# Altium schematic sheet [15] - ETHERNET PHY.SchDoc
size A2; DocumentNumber: 15; SheetNumber: 15; SheetTotal: 32
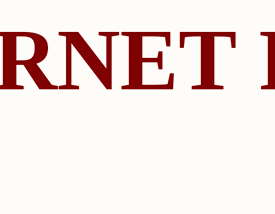
[diagram p0: [15] - ETHERNET PHY.SchDoc, top left]
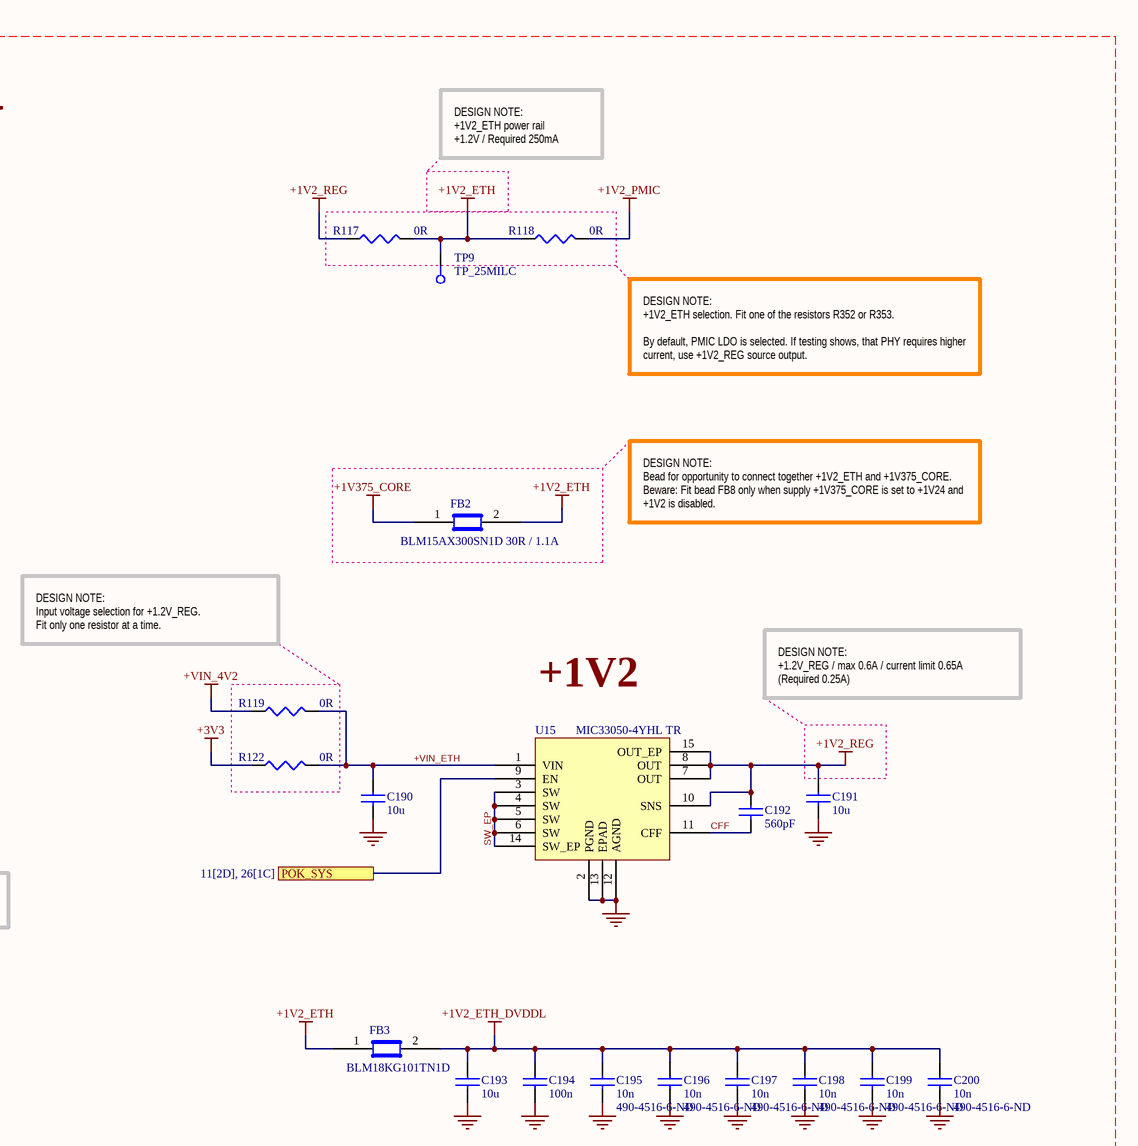
[diagram p1: [15] - ETHERNET PHY.SchDoc, top right]
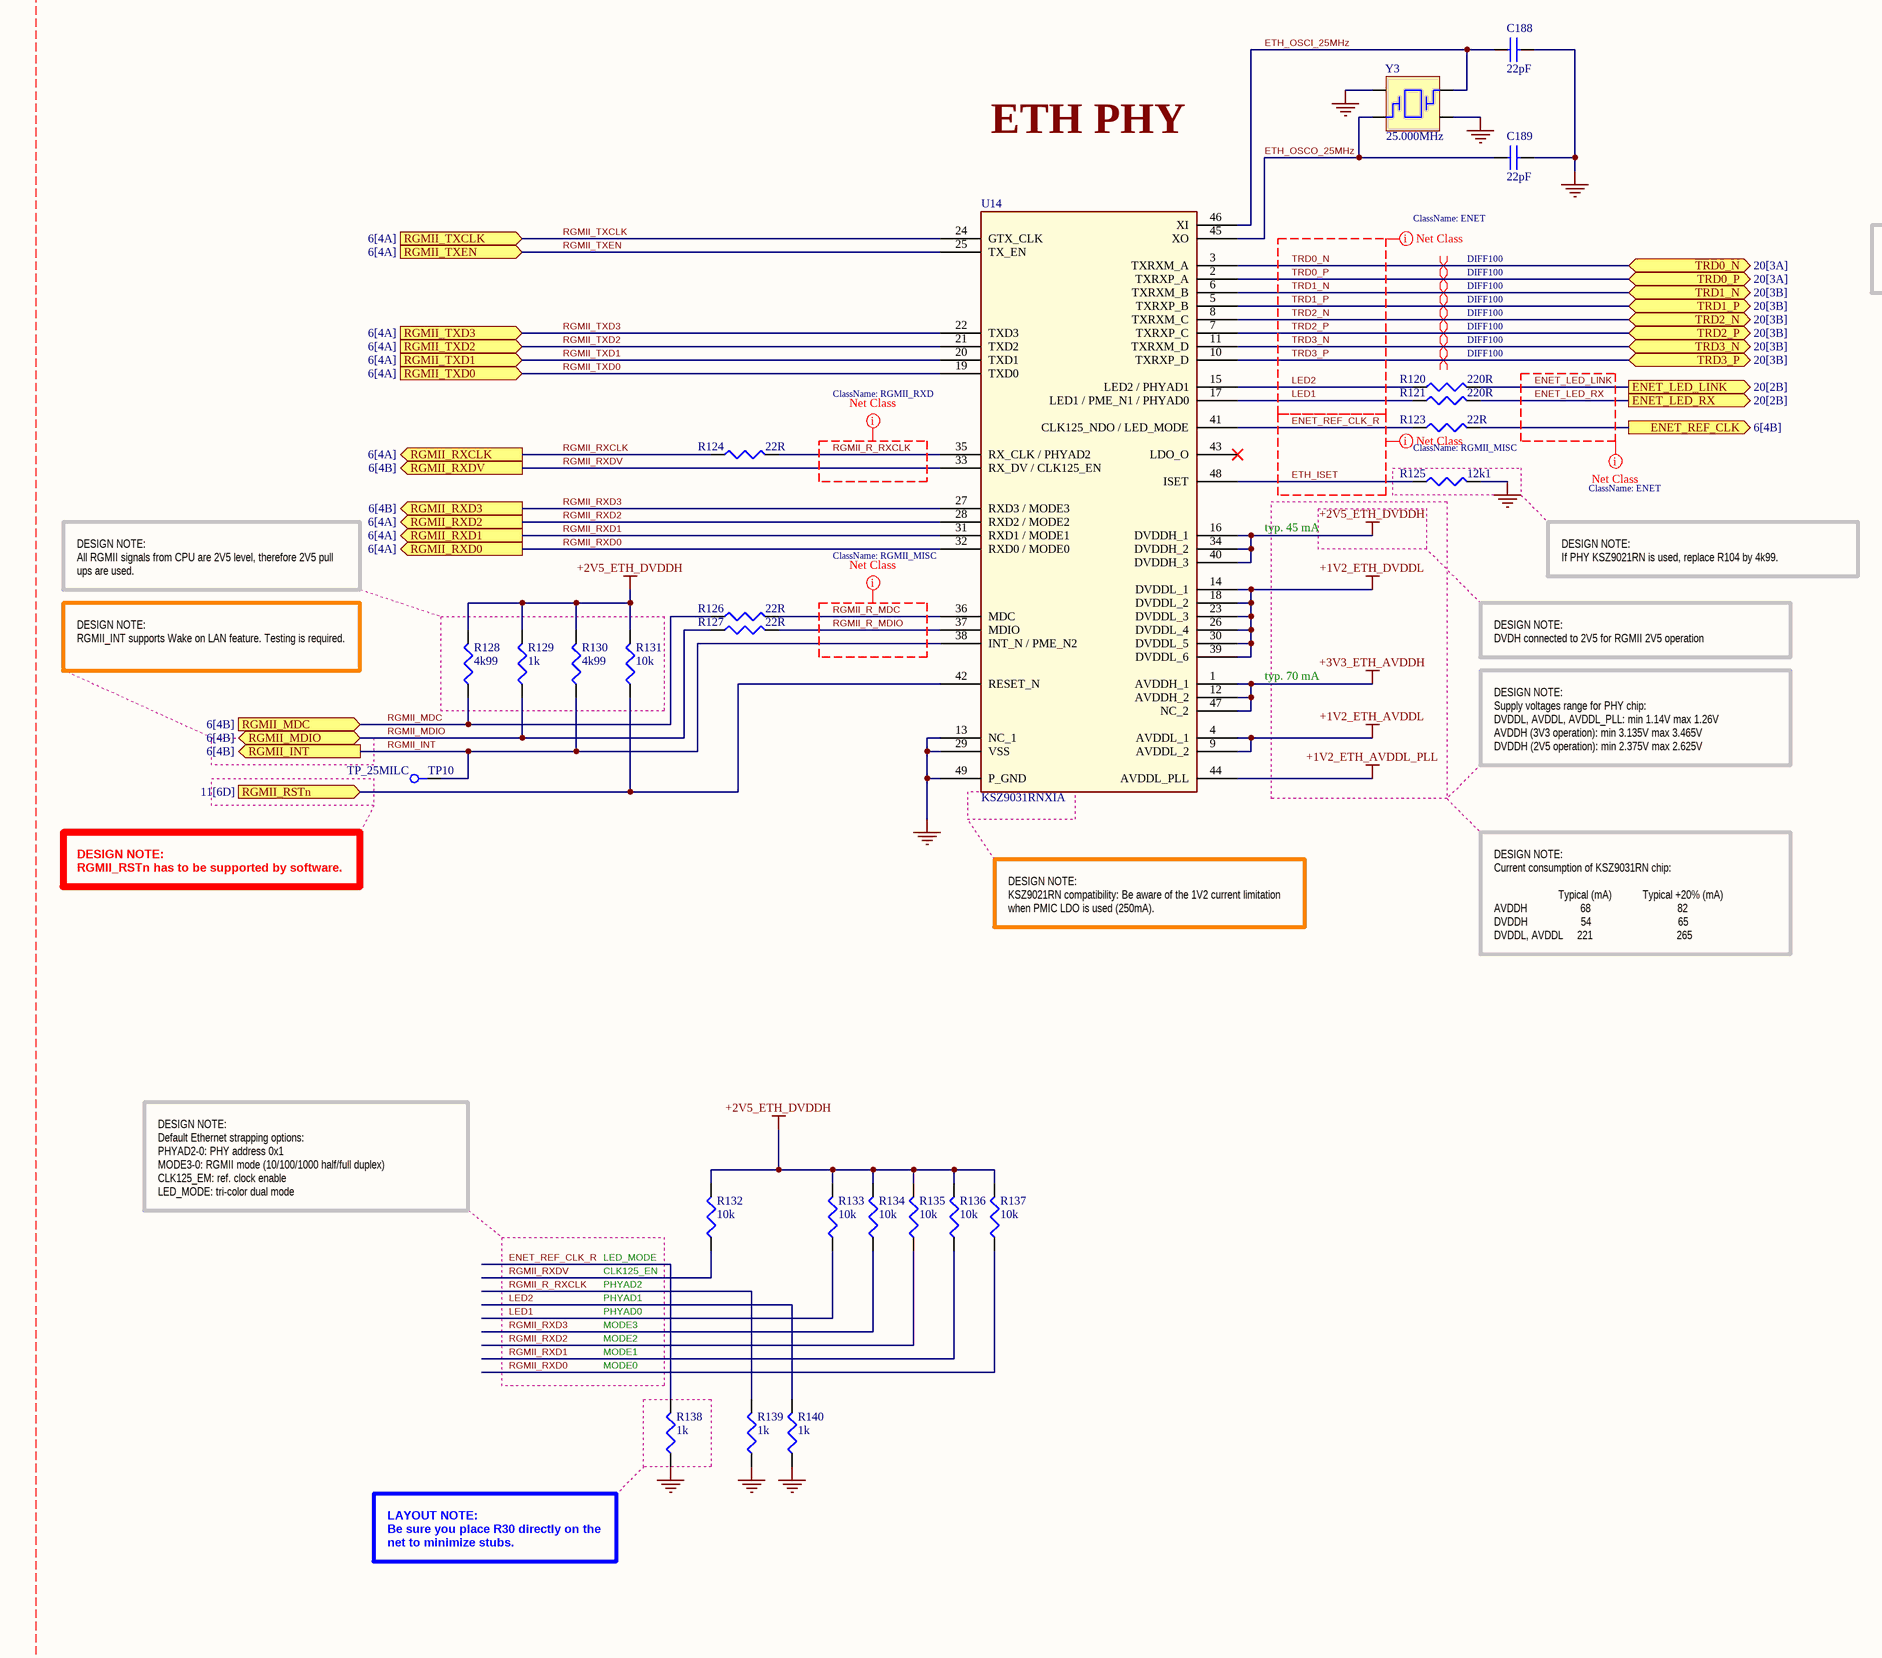
[diagram p2: [15] - ETHERNET PHY.SchDoc, bottom left]
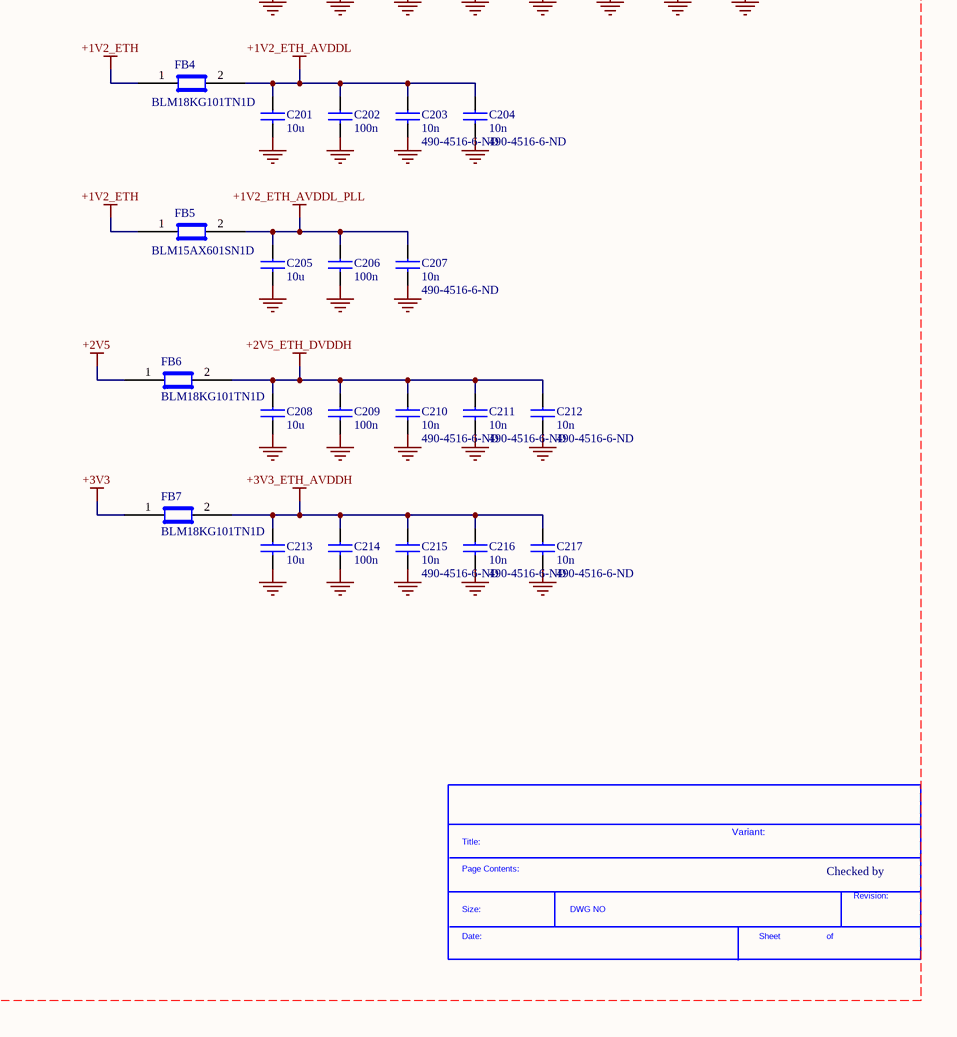
[diagram p3: [15] - ETHERNET PHY.SchDoc, bottom right]

## Parts
*  SDTitleBlock  (value not drawn)  (graphical)
C188  22pF  [C0402]
C189  22pF  [C0402]
C190  10u  [C0603]
C191  10u  [C0603]
C192  560pF  [C0402]
C193  10u  [C0603]
C194  100n  [C0402]
C195  10n  Supplier Part Number 2: 490-4516-6-ND  [C0402]
C196  10n  Supplier Part Number 2: 490-4516-6-ND  [C0402]
C197  10n  Supplier Part Number 2: 490-4516-6-ND  [C0402]
C198  10n  Supplier Part Number 2: 490-4516-6-ND  [C0402]
C199  10n  Supplier Part Number 2: 490-4516-6-ND  [C0402]
C200  10n  Supplier Part Number 2: 490-4516-6-ND  [C0402]
C201  10u  [C0603]
C202  100n  [C0402]
C203  10n  Supplier Part Number 2: 490-4516-6-ND  [C0402]
C204  10n  Supplier Part Number 2: 490-4516-6-ND  [C0402]
C205  10u  [C0603]
C206  100n  [C0402]
C207  10n  Supplier Part Number 2: 490-4516-6-ND  [C0402]
C208  10u  [C0603]
C209  100n  [C0402]
C210  10n  Supplier Part Number 2: 490-4516-6-ND  [C0402]
C211  10n  Supplier Part Number 2: 490-4516-6-ND  [C0402]
C212  10n  Supplier Part Number 2: 490-4516-6-ND  [C0402]
C213  10u  [C0603]
C214  100n  [C0402]
C215  10n  Supplier Part Number 2: 490-4516-6-ND  [C0402]
C216  10n  Supplier Part Number 2: 490-4516-6-ND  [C0402]
C217  10n  Supplier Part Number 2: 490-4516-6-ND  [C0402]
FB2  BLM15AX300SN1D 30R / 1.1A  [C0402]
FB3  BLM18KG101TN1D  [C0603]
FB4  BLM18KG101TN1D  [C0603]
FB5  BLM15AX601SN1D  [C0402]
FB6  BLM18KG101TN1D  [C0603]
FB7  BLM18KG101TN1D  [C0603]
R117  0R  [R0402]
R118  0R  [R0402]
R119  0R  [R0402]
R120  220R  [R0402]
R121  220R  [R0402]
R122  0R  [R0402]
R123  22R  [R0402]
R124  22R  [R0402]
R125  12k1  [R0402]
R126  22R  [R0402]
R127  22R  [R0402]
R128  4k99  [R0402]
R129  1k  [R0402]
R130  4k99  [R0402]
R131  10k  [R0402]
R132  10k  [R0402]
R133  10k  [R0402]
R134  10k  [R0402]
R135  10k  [R0402]
R136  10k  [R0402]
R137  10k  [R0402]
R138  1k  [R0402]
R139  1k  [R0402]
R140  1k  [R0402]
TP9  TP_25MILC  [TP_25C]  (no BOM)
TP10  TP_25MILC  [TP_25C]  (no BOM)
U14  KSZ9031RNXIA  [QFN48_SMALL_EP_7MMX7MM]
U15  MIC33050-4YHL TR  [MLF_3x3_12PINS]
Y3  25.000MHz  [ABM8G]

## Ports
ENET_LED_LINK (out, see 20[2B]), ENET_LED_RX (out, see 20[2B]), ENET_REF_CLK (out, see 6[4B]), POK_SYS (see 11[2D], 26[1C]), RGMII_INT (out, see 6[4B]), RGMII_MDC (in, see 6[4B]), RGMII_MDIO (bidir, see 6[4B]), RGMII_RSTn (in, see 11[6D]), RGMII_RXCLK (out, see 6[4A]), RGMII_RXD0 (out, see 6[4A]), RGMII_RXD1 (out, see 6[4A]), RGMII_RXD2 (out, see 6[4A]), RGMII_RXD3 (out, see 6[4B]), RGMII_RXDV (out, see 6[4B]), RGMII_TXCLK (in, see 6[4A]), RGMII_TXD0 (in, see 6[4A]), RGMII_TXD1 (in, see 6[4A]), RGMII_TXD2 (in, see 6[4A]), RGMII_TXD3 (in, see 6[4A]), RGMII_TXEN (in, see 6[4A]), TRD0_N (bidir, see 20[3A]), TRD0_P (bidir, see 20[3A]), TRD1_N (bidir, see 20[3B]), TRD1_P (bidir, see 20[3B]), TRD2_N (bidir, see 20[3B]), TRD2_P (bidir, see 20[3B]), TRD3_N (bidir, see 20[3B]), TRD3_P (bidir, see 20[3B])

## Nets
+1V2_ETH: FB2.2 FB3.1 FB4.1 FB5.1 R117.2 R118.1 TP9.1
+1V2_ETH_AVDDL: C201.1 C202.1 C203.1 C204.1 FB4.2 U14.4(AVDDL_1) U14.9(AVDDL_2)
+1V2_ETH_AVDDL_PLL: C205.1 C206.1 C207.1 FB5.2 U14.44(AVDDL_PLL)
+1V2_ETH_DVDDL: C193.1 C194.1 C195.1 C196.1 C197.1 C198.1 C199.1 C200.1 FB3.2 U14.14(DVDDL_1) U14.18(DVDDL_2) U14.23(DVDDL_3) U14.26(DVDDL_4) U14.30(DVDDL_5) U14.39(DVDDL_6)
+1V2_PMIC: R118.2
+1V2_REG: C191.1 C192.1 R117.1 U15.7(OUT) U15.8(OUT) U15.10(SNS) U15.15(OUT_EP)
+1V375_CORE: FB2.1
+2V5: FB6.1
+2V5_ETH_DVDDH: C208.1 C209.1 C210.1 C211.1 C212.1 FB6.2 R128.2 R129.2 R130.2 R131.2 R132.2 R133.2 R134.2 R135.2 R136.2 R137.2 U14.16(DVDDH_1) U14.34(DVDDH_2) U14.40(DVDDH_3)
+3V3: FB7.1 R122.1
+3V3_ETH_AVDDH: C213.1 C214.1 C215.1 C216.1 C217.1 FB7.2 U14.1(AVDDH_1) U14.12(AVDDH_2) U14.47(NC_2)
+VIN_4V2: R119.1
GND: C188.2 C189.2 C190.2 C191.2 C193.2 C194.2 C195.2 C196.2 C197.2 C198.2 C199.2 C200.2 C201.2 C202.2 C203.2 C204.2 C205.2 C206.2 C207.2 C208.2 C209.2 C210.2 C211.2 C212.2 C213.2 C214.2 C215.2 C216.2 C217.2 R125.2 R138.1 R139.1 R140.1 U14.13(NC_1) U14.29(VSS) U14.49(P_GND) U15.2(PGND) U15.12(AGND) U15.13(EPAD) Y3.2 Y3.4
+VIN_ETH: C190.1 R119.2 R122.2 U15.1(VIN)
CFF: C192.2 U15.11(CFF)
ENET_LED_LINK: R120.2 ; port ENET_LED_LINK
ENET_LED_RX: R121.2 ; port ENET_LED_RX
ENET_REF_CLK: R123.2 ; port ENET_REF_CLK
ENET_REF_CLK_R: R123.1 R138.2 U14.41(CLK125_NDO_/_LED_MODE)
ETH_ISET: R125.1 U14.48(ISET)
ETH_OSCI_25MHz: C188.1 U14.46(XI) Y3.3
ETH_OSCO_25MHz: C189.1 U14.45(XO) Y3.1
LED1: R121.1 R133.1 U14.17(LED1_/_PME_N1_/_PHYAD0)
LED2: R120.1 R140.2 U14.15(LED2_/_PHYAD1)
POK_SYS: U15.9(EN) ; port POK_SYS
RGMII_INT: R130.1 TP10.1 U14.38(INT_N_/_PME_N2) ; port RGMII_INT
RGMII_MDC: R126.1 R128.1 ; port RGMII_MDC
RGMII_MDIO: R127.1 R129.1 ; port RGMII_MDIO
RGMII_R_MDC: R126.2 U14.36(MDC)
RGMII_R_MDIO: R127.2 U14.37(MDIO)
RGMII_R_RXCLK: R124.2 R139.2 U14.35(RX_CLK_/_PHYAD2)
RGMII_RSTn: R131.1 U14.42(RESET_N) ; port RGMII_RSTn
RGMII_RXCLK: R124.1 ; port RGMII_RXCLK
RGMII_RXD0: R137.1 U14.32(RXD0_/_MODE0) ; port RGMII_RXD0
RGMII_RXD1: R136.1 U14.31(RXD1_/_MODE1) ; port RGMII_RXD1
RGMII_RXD2: R135.1 U14.28(RXD2_/_MODE2) ; port RGMII_RXD2
RGMII_RXD3: R134.1 U14.27(RXD3_/_MODE3) ; port RGMII_RXD3
RGMII_RXDV: R132.1 U14.33(RX_DV_/_CLK125_EN) ; port RGMII_RXDV
RGMII_TXCLK: U14.24(GTX_CLK) ; port RGMII_TXCLK
RGMII_TXD0: U14.19(TXD0) ; port RGMII_TXD0
RGMII_TXD1: U14.20(TXD1) ; port RGMII_TXD1
RGMII_TXD2: U14.21(TXD2) ; port RGMII_TXD2
RGMII_TXD3: U14.22(TXD3) ; port RGMII_TXD3
RGMII_TXEN: U14.25(TX_EN) ; port RGMII_TXEN
SW_EP: U15.3(SW) U15.4(SW) U15.5(SW) U15.6(SW) U15.14(SW_EP)
TRD0_N: U14.3(TXRXM_A) ; port TRD0_N
TRD0_P: U14.2(TXRXP_A) ; port TRD0_P
TRD1_N: U14.6(TXRXM_B) ; port TRD1_N
TRD1_P: U14.5(TXRXP_B) ; port TRD1_P
TRD2_N: U14.8(TXRXM_C) ; port TRD2_N
TRD2_P: U14.7(TXRXP_C) ; port TRD2_P
TRD3_N: U14.11(TXRXM_D) ; port TRD3_N
TRD3_P: U14.10(TXRXP_D) ; port TRD3_P

Not connected (* = marked no-connect by the designer): U14 43(LDO_O)*

## Layout directives
differential pair; net class DIFF100: TRD0_N, TRD0_P, TRD1_N, TRD1_P, TRD2_N, TRD2_P, TRD3_N, TRD3_P
net class ENET: ENET_LED_LINK, ENET_LED_RX, LED1, LED2, TRD0_N, TRD0_P, TRD1_N, TRD1_P, TRD2_N, TRD2_P, TRD3_N, TRD3_P
net class RGMII_MISC: ENET_REF_CLK_R, ETH_ISET, RGMII_R_MDC, RGMII_R_MDIO
net class RGMII_RXD: RGMII_R_RXCLK
net class [15] - ETHERNET PHY: +1V2_ETH, +1V2_ETH_AVDDL, +1V2_ETH_AVDDL_PLL, +1V2_ETH_DVDDL, +1V2_PMIC, +1V2_REG, +1V375_CORE, +2V5, +2V5_ETH_DVDDH, +3V3, +3V3_ETH_AVDDH, +VIN_4V2, +VIN_ETH, CFF, ENET_LED_LINK, ENET_LED_RX, ENET_REF_CLK_R, ETH_ISET, ETH_OSCI_25MHz, ETH_OSCO_25MHz, GND, LED1, LED2, RGMII_INT, RGMII_MDC, RGMII_MDIO, RGMII_R_MDC, RGMII_R_MDIO, RGMII_R_RXCLK, RGMII_RXCLK, RGMII_RXD0, RGMII_RXD1, RGMII_RXD2, RGMII_RXD3, RGMII_RXDV, RGMII_TXCLK, RGMII_TXD0, RGMII_TXD1, RGMII_TXD2, RGMII_TXD3, RGMII_TXEN, SW_EP, TRD0_N, TRD0_P, TRD1_N, TRD1_P, TRD2_N, TRD2_P, TRD3_N, TRD3_P

## Notes on the sheet
- ETHERNET PHY
- DESIGN NOTE:
  +1V2_ETH power rail
  +1.2V / Required 250mA
- DESIGN NOTE:
  +1V2_ETH selection. Fit one of the resistors R352 or R353.
  By default, PMIC LDO is selected. If testing shows, that PHY requires higher current, use +1V2_REG source output.
- ETH PHY
- DESIGN NOTE:
  Bead for opportunity to connect together +1V2_ETH and +1V375_CORE. Beware: Fit bead FB8 only when supply +1V375_CORE is set to +1V24 and +1V2 is disabled.
- DESIGN NOTE:
  Input voltage selection for +1.2V_REG.
  Fit only one resistor at a time.
- +1V2
- DESIGN NOTE:
  +1.2V_REG / max 0.6A / current limit 0.65A
  (Required 0.25A)
- typ. 45 mA
- DESIGN NOTE:
  If PHY KSZ9021RN is used, replace R104 by 4k99.
- DESIGN NOTE:
  All RGMII signals from CPU are 2V5 level, therefore 2V5 pull ups are used.
- DESIGN NOTE:
  RGMII_INT supports Wake on LAN feature. Testing is required.
- typ. 70 mA
- DESIGN NOTE:
  DVDH connected to 2V5 for RGMII 2V5 operation
- DESIGN NOTE:
  Supply voltages range for PHY chip:
  DVDDL, AVDDL, AVDDL_PLL: min 1.14V max 1.26V
  AVDDH (3V3 operation): min 3.135V max 3.465V
  DVDDH (2V5 operation): min 2.375V max 2.625V
- DESIGN NOTE:
  RGMII_RSTn has to be supported by software.
- DESIGN NOTE:
  KSZ9021RN compatibility: Be aware of the 1V2 current limitation when PMIC LDO is used (250mA).
- DESIGN NOTE:
  Current consumption of KSZ9031RN chip:
  Typical (mA)           Typical +20% (mA)
  AVDDH                   68                               82
  DVDDH                   54                               65
  DVDDL, AVDDL     221                              265
- DESIGN NOTE:
  Default Ethernet strapping options:
  PHYAD2-0: PHY address 0x1
  MODE3-0: RGMII mode (10/100/1000 half/full duplex)
  CLK125_EM: ref. clock enable
  LED_MODE: tri-color dual mode
- LED_MODE
- CLK125_EN
- PHYAD2
- PHYAD1
- PHYAD0
- MODE0
- MODE1
- MODE2
- MODE3
- LAYOUT NOTE:
  Be sure you place R30 directly on the net to minimize stubs.
- Variant:
- Checked by
- (in symbol SDTitleBlock) Title:; Page Contents:; Revision:; Size:; DWG NO; Date:; Sheet; of

## Library data of the parts
C188 C189 = C1005C0G1H220J: CAP CER 22PF 50V C0G 5% 0402; Manufacturer: TDK Corporation; .Checked PCB: used; Temperature Coefficient: C0G, NP0; Capacitance: 22pF; Category: Capacitors; Manufacturer Part Number: C1005C0G1H220J; Operating Temperature: -55°C ~ 125°C; Package / Case: 0402 (1005 Metric); Price 1k [$]: 0.00442; Value: 22pF; .Checked SCH: used; Voltage - Rated: 50V; Supplier Part Number: 445-1239-1-ND; Supplier: Digikey; Supplier 1: Digi-Key; Supplier Part Number 1: 445-1239-1-ND; RoHS: RoHS Compliant; Stock 1: 176261; Pricing 1: 1=0.08, 10=0.05, 100=0.018, 250=0.013, 500=0.0096, 1000=0.0065 (USD); Tolerance: ±5%; Mounting Type: Surface Mount, MLCC; Applications: General Purpose; Ratings: -; Size / Dimension: 0.039" L x 0.020" W (1.00mm x 0.50mm); Height - Seated (Max): -; Thickness (Max): 0.022" (0.55mm); Lead Spacing: -; Features: -; Packaging: Cut Tape (CT); Lead Style: -; ComponentLink1URL: http://www.tdk.co.jp/tefe02/e412_c.pdf; ComponentLink1Description: http://www.tdk.co.jp/tefe02/e412_c.pdf
C190 C191 C193 C201 C205 C208 C213 = C1608X5R0J106M: CAP CER 10UF 6.3V X5R 20% 0603; Manufacturer: TDK Corporation; Capacitance: 10µF; Value: 10µF; .Checked PCB: used; Category: Capacitors; Manufacturer Part Number: C1608X5R0J106M; Operating Temperature: -55°C ~ 85°C; Package / Case: 0603 (1608 Metric); Price 1k [$]: 0.08580; .Checked SCH: used; Voltage - Rated: 6.3V; Features: Low ESR; Supplier Part Number: 445-4112-1-ND; Supplier: Digikey; Supplier 1: Digi-Key; Supplier Part Number 1: 445-4112-1-ND; RoHS: RoHS Compliant; Stock 1: 48157; Pricing 1: 1=0.46, 10=0.363, 100=0.1898, 250=0.14024, 500=0.1089, 1000=0.0858 (USD); Tolerance: ±20%; Temperature Coefficient: X5R; Mounting Type: Surface Mount, MLCC; Applications: General Purpose; Ratings: -; Size / Dimension: 0.063" L x 0.031" W (1.60mm x 0.80mm); Height - Seated (Max): -; Thickness (Max): 0.037" (0.95mm); Lead Spacing: -; Packaging: Cut Tape (CT); Lead Style: -; ComponentLink1URL: http://www.tdk.com/pdf/general_B11.pdf; ComponentLink1Description: http://www.tdk.com/pdf/general_B11.pdf
C192 = GRM1555C1H561JA01D: CAP CER 560PF 50V C0G 0402; Manufacturer: Murata Electronics North America; .Checked PCB: used; Tolerance: ±5%; Temperature Coefficient: C0G, NP0; Capacitance: 560pF; Category: Capacitors; Supplier Part Number: 490-3238-1-ND; Manufacturer Part Number: GRM1555C1H561JA01D; Operating Temperature: -55°C ~ 125°C; Package / Case: 0402 (1005 Metric); Price 1k [$]: 0.0149; Value: 560pF; .Checked SCH: used; Voltage - Rated: 50V; Supplier: Digikey; Supplier 1: Digi-Key; Supplier Part Number 1: 490-3238-1-ND; RoHS: RoHS Compliant; Stock 1: 301161; Pricing 1: 10=0.066, 50=0.0528, 100=0.0396, 250=0.0286, 500=0.02112, 1000=0.0143, 5000=0.011 (USD); Mounting Type: Surface Mount, MLCC; Applications: General Purpose; Ratings: -; Size / Dimension: 0.039" L x 0.020" W (1.00mm x 0.50mm); Height - Seated (Max): -; Thickness (Max): 0.022" (0.55mm); Lead Spacing: -; Features: -; Packaging: Cut Tape (CT); Lead Style: -; ComponentLink1URL: http://search.murata.co.jp/Ceramy/image/img/PDF/ENG/GRM1555C1H561JA01.pdf; ComponentLink1Description: http://search.murata.co.jp/Ceramy/image/img/PDF/ENG/GRM1555C1H561JA01.pdf; Supplier 2: Digi-Key; Supplier Part Number 2: 1276-1709-1-ND
C194 C202 C206 C209 C214 = C1005X5R1H104K: CAP CER .10UF 50V X5R 10% 0402; Manufacturer: TDK Corporation; Capacitance: 0.1µF; Value: 100nF; .Checked PCB: used; Category: Capacitors; Manufacturer Part Number: C1005X5R1H104K; Operating Temperature: -55°C ~ 85°C; Package / Case: 0402 (1005 Metric); Price 1k [$]: 0.02340; .Checked SCH: used; Voltage - Rated: 50V; Supplier Part Number: 445-5942-1-ND; Supplier: Digikey; Supplier 1: Digi-Key; Supplier Part Number 1: 445-5942-1-ND; RoHS: RoHS Compliant; Stock 1: 106926; Pricing 1: 1=0.27, 10=0.18, 100=0.072, 250=0.05176, 500=0.0369, 1000=0.027 (USD); Tolerance: ±10%; Temperature Coefficient: X5R; Mounting Type: Surface Mount, MLCC; Applications: General Purpose; Ratings: -; Size / Dimension: 0.039" L x 0.020" W (1.00mm x 0.50mm); Height - Seated (Max): -; Thickness (Max): 0.022" (0.55mm); Lead Spacing: -; Features: -; Packaging: Cut Tape (CT); Lead Style: -; ComponentLink1URL: http://www.tdk.co.jp/tefe02/e412_c.pdf; ComponentLink1Description: http://www.tdk.co.jp/tefe02/e412_c.pdf; Supplier 2: Digi-Key; Supplier Part Number 2: 311-1697-6-ND
C195-C200 C203 C204 C207 C210-C212 C215-C217 = C1005X7R1H103K: CAP CER 10000PF 50V 10% X7R 0402; Manufacturer: TDK Corporation; Value: 10nF; .Checked PCB: used; Capacitance: 10000pF; Category: Capacitors; Manufacturer Part Number: C1005X7R1H103K; Operating Temperature: -55°C ~ 125°C; Package / Case: 0402 (1005 Metric); Price 1k [$]: 0.01625; .Checked SCH: used; Voltage - Rated: 50V; Supplier Part Number: 445-6850-1-ND; Supplier: Digikey; Supplier 1: Digi-Key; Supplier Part Number 1: 445-6850-1-ND; RoHS: RoHS Compliant; Stock 1: 3901; Pricing 1: 1=0.2, 10=0.125, 100=0.045, 250=0.03252, 500=0.024, 1000=0.01625 (USD); Tolerance: ±10%; Temperature Coefficient: X7R; Mounting Type: Surface Mount, MLCC; Applications: General Purpose; Ratings: -; Size / Dimension: 0.039" L x 0.020" W (1.00mm x 0.50mm); Height - Seated (Max): -; Thickness (Max): 0.022" (0.55mm); Lead Spacing: -; Features: -; Packaging: Cut Tape (CT); Lead Style: -; ComponentLink1URL: http://www.tdk.co.jp/tefe02/e412_c.pdf; ComponentLink1Description: http://www.tdk.co.jp/tefe02/e412_c.pdf; Supplier 2: Digi-Key
FB2 = BLM15AX300SN1D: FERRITE CHIP 30 OHM 1100MA 0402; Manufacturer: Murata Electronics North America; Impedance @ Frequency: 30 Ohm @ 100MHz; DC Resistance (DCR): 60 mOhm Max; Filter Type: Differential Mode - Single; Number of Lines: 1; .Checked PCB: used; Supplier 1: Digi-Key; Supplier Part Number 1: 490-5682-1-ND; Manufacturer Part Number: BLM15AX300SN1D; RoHS: RoHS Compliant; Category: Filters; Stock 1: 29684; Pricing 1: 1=0.26, 10=0.194, 50=0.1134, 100=0.0907, 250=0.0648, 500=0.04406, 1000=0.03564, 5000=0.02786 (USD); Current Rating: 1.1A; Package / Case: 0402 (1005 Metric); Mounting Type: Surface Mount; Packaging: Cut Tape (CT); Height (Max): 0.022" (0.55mm); Size / Dimension: 0.039" L x 0.020" W (1.00mm x 0.50mm); ComponentLink1URL: http://search.murata.co.jp/Ceramy/image/img/PDF/ENG/L0110S0100BLM15AX_SN.pdf; ComponentLink1Description: http://search.murata.co.jp/Ceramy/image/img/PDF/ENG/L0110S0100BLM15AX_SN.pdf; .Checked SCH: used
FB3 FB4 FB6 FB7 = BLM18KG101TN1D: FERRITE CHIP 100 OHM BEAD 0603 3A; Manufacturer: Murata Electronics North America; .Checked PCB: used; Impedance @ Frequency: 100 Ohm @ 100MHz; DC Resistance (DCR): 30 mOhm Max; Filter Type: Differential Mode - Single; Number of Lines: 1; .Checked SCH: used; Category: Filters; Manufacturer Part Number: BLM18KG101TN1D; Package / Case: 0603 (1608 Metric); Price 1k [$]: 0.04320; Value: BLM18KG101TN1D; Current Rating: 3A; Supplier Part Number: 490-5448-1-ND; Supplier: Digikey; Supplier 1: Digi-Key; Supplier Part Number 1: 490-5448-1-ND; RoHS: RoHS Compliant; Stock 1: 10314; Pricing 1: 1=0.35, 10=0.23, 50=0.1196, 100=0.0922, 250=0.06624, 500=0.04724, 1000=0.03456 (USD); Mounting Type: Surface Mount; Packaging: Cut Tape (CT); Height (Max): 0.030" (0.75mm); Size / Dimension: 0.063" L x 0.031" W (1.60mm x 0.80mm); ComponentLink1URL: http://search.murata.co.jp/Ceramy/image/img/PDF/ENG/L0110S0100BLM18K.pdf; ComponentLink1Description: http://search.murata.co.jp/Ceramy/image/img/PDF/ENG/L0110S0100BLM18K.pdf
FB5 = BLM15AX601SN1D: FERRITE CHIP 600 OHM 0402 420mA; Manufacturer: Murata Electronics North America; .Checked PCB: used; Impedance @ Frequency: 600 Ohm @ 100MHz; DC Resistance (DCR): 340 mOhm Max; Filter Type: Differential Mode - Single; Number of Lines: 1; .Checked SCH: used; Category: Filters; Manufacturer Part Number: BLM15AX601SN1D; Package / Case: 0402 (1005 Metric); Current Rating: 420mA; Supplier 1: Digi-Key; Supplier Part Number 1: 490-5441-1-ND; RoHS: RoHS Compliant; Stock 1: 34008; Pricing 1: 1=0.26, 10=0.197, 50=0.1148, 100=0.0918, 250=0.0656, 500=0.0446, 1000=0.03608, 5000=0.02821 (USD); Mounting Type: Surface Mount; Packaging: Cut Tape (CT); Height (Max): 0.022" (0.55mm); Size / Dimension: 0.039" L x 0.020" W (1.00mm x 0.50mm); ComponentLink1URL: http://search.murata.co.jp/Ceramy/image/img/PDF/ENG/L0110S0100BLM15AX_SN.pdf; ComponentLink1Description: http://search.murata.co.jp/Ceramy/image/img/PDF/ENG/L0110S0100BLM15AX_SN.pdf; Supplier Part Number: 490-5441-1-ND; Price 1k [$]: 0.03280; Value: BLM15AX601SN1D; Supplier: Digikey
R117-R119 R122 = RC0402JR-070RL: RES 0.0 OHM 1/16W 0402 SMD; Manufacturer: Yageo; Resistance (Ohms): 0.0; Power (Watts): 0.063W, 1/16W; Tolerance: Jumper; .Checked PCB: used; Category: Resistors; Supplier Part Number: 311-0.0JRCT-ND; Manufacturer Part Number: RC0402JR-070RL; Package / Case: 0402 (1005 Metric); Price 1k [$]: 0.01389; Value: 0R; .Checked SCH: used; Supplier: Digikey; Supplier 1: Digi-Key; Supplier Part Number 1: 311-0.0JRCT-ND; RoHS: RoHS Compliant; Stock 1: 1106330; Pricing 1: 10=0.012, 50=0.009, 100=0.0069, 250=0.00512, 500=0.0038, 1000=0.00253 (USD); Composition: Thick Film; Features: -; Temperature Coefficient: -; Size / Dimension: 0.039" L x 0.020" W (1.00mm x 0.50mm); Height: 0.016" (0.40mm); Number of Terminations: 2; Packaging: Cut Tape (CT); ComponentLink1URL: http://www.yageo.com/documents/recent/PYu-RC0402_51_RoHS_L_6.pdf; ComponentLink1Description: http://www.yageo.com/documents/recent/PYu-RC0402_51_RoHS_L_6.pdf
R120 R121 = RC0402FR-07220RL: RES 220 OHM 1/16W 1% 0402 SMD; Manufacturer: Yageo; Resistance (Ohms): 220; Power (Watts): 0.063W, 1/16W; .Checked PCB: used; Temperature Coefficient: ±100ppm/°C; Category: Resistors; Manufacturer Part Number: RC0402FR-07220RL; Package / Case: 0402 (1005 Metric); Price 1k [$]: 0.01421; Tolerance: ±1%; Value: 220R; .Checked SCH: used; Supplier Part Number: 311-220LRCT-ND; Supplier: Digikey; Supplier 1: Digi-Key; Supplier Part Number 1: 311-220LRCT-ND; RoHS: RoHS Compliant; Stock 1: 276463; Pricing 1: 10=0.014, 50=0.0104, 100=0.0079, 250=0.00584, 500=0.00432, 1000=0.00288 (USD); Composition: Thick Film; Features: -; Size / Dimension: 0.039" L x 0.020" W (1.00mm x 0.50mm); Height: 0.016" (0.40mm); Number of Terminations: 2; Packaging: Cut Tape (CT); ComponentLink1URL: http://www.yageo.com/documents/recent/PYu-RC0402_51_RoHS_L_6.pdf; ComponentLink1Description: http://www.yageo.com/documents/recent/PYu-RC0402_51_RoHS_L_6.pdf
R123 R124 R126 R127 = RC0402FR-0722RL: RES 22.0 OHM 1/16W 1% 0402 SMD; Manufacturer: Yageo; Resistance (Ohms): 22; Power (Watts): 0.063W, 1/16W; .Checked PCB: used; Temperature Coefficient: ±100ppm/°C; Category: Resistors; Manufacturer Part Number: RC0402FR-0722RL; Package / Case: 0402 (1005 Metric); Price 1k [$]: 0.01421; Tolerance: ±1%; Value: 22R; .Checked SCH: used; Supplier Part Number: 311-22.0LRCT-ND; Supplier: Digikey; Supplier 1: Digi-Key; Supplier Part Number 1: 311-22.0LRCT-ND; RoHS: RoHS Compliant; Stock 1: 943800; Pricing 1: 10=0.014, 50=0.0104, 100=0.0079, 250=0.00584, 500=0.00432, 1000=0.00288 (USD); Composition: Thick Film; Features: -; Size / Dimension: 0.039" L x 0.020" W (1.00mm x 0.50mm); Height: 0.016" (0.40mm); Number of Terminations: 2; Packaging: Cut Tape (CT); ComponentLink1URL: http://www.yageo.com/documents/recent/PYu-RC0402_51_RoHS_L_6.pdf; ComponentLink1Description: http://www.yageo.com/documents/recent/PYu-RC0402_51_RoHS_L_6.pdf
R125 = RC0402FR-0712K1L: RES SMD 12.1K OHM 1% 1/16W 0402; Manufacturer: Yageo; Power (Watts): 0.063W, 1/16W; Temperature Coefficient: ±100ppm/°C; .Creator: MM; .Checked PCB: used; Supplier 1: Digi-Key; Manufacturer Part Number: RC0402FR-0712K1L; RoHS: RoHS Compliant; Category: Resistors; Stock 1: 327554; Pricing 1: 1=0.1, 10=0.015, 25=0.0108, 100=0.006, 250=0.00456, 500=0.00364, 1000=0.00268, 2500=0.00233, 5000=0.00192 (USD); Packaging: Cut Tape (CT); Resistance (Ohms): 12.1k; Tolerance: ±1%; Composition: Thick Film; Features: Moisture Resistant; Operating Temperature: -55°C ~ 155°C; Package / Case: 0402 (1005 Metric); Supplier Device Package: 0402; Size / Dimension: 0.039" L x 0.020" W (1.00mm x 0.50mm); Height: 0.016" (0.40mm); Number of Terminations: 2; ComponentLink1URL: http://www.yageo.com/NewPortal/yageodocoutput?fileName=/pdf/R-Chip/PYu-RC_Group_51_RoHS_L_0.pdf; ComponentLink1Description: http://www.yageo.com/NewPortal/yageodocoutput?fileName=/pdf/R-Chip/PYu-RC_Group_51_RoHS_L_0.pdf; Supplier Part Number 1: 311-12.1KLRCT-ND; .Checked SCH: used
R128 R130 = RMCF0402FT4K99: RES TF 4.99K OHM 1% 1/16W 0402; Manufacturer: Stackpole Electronics Inc; Power (Watts): 0.063W, 1/16W; .Checked PCB: used; Temperature Coefficient: ±100ppm/°C; Category: Resistors; Manufacturer Part Number: RMCF0402FT4K99; Package / Case: 0402 (1005 Metric); Price 1k [$]: 0.00384; Resistance (Ohms): 4.99K; Tolerance: ±1%; Value: 4k99; .Checked SCH: used; Supplier Part Number: RMCF0402FT4K99CT-ND; Supplier: Digikey; Supplier 1: Digi-Key; Supplier Part Number 1: RMCF0402FT4K99CT-ND; RoHS: RoHS Compliant; Stock 1: 48509; Pricing 1: 1=0.04, 10=0.025, 50=0.0138, 100=0.0105, 250=0.0078, 500=0.00576, 1000=0.00384 (USD); Composition: Thick Film; Features: -; Size / Dimension: 0.039" L x 0.020" W (1.00mm x 0.50mm); Height: 0.016" (0.40mm); Number of Terminations: 2; Packaging: Cut Tape (CT); ComponentLink1URL: http://www.seielect.com/Catalog/SEI-RMCF.pdf; ComponentLink1Description: http://www.seielect.com/Catalog/SEI-RMCF.pdf
R129 R138-R140 = RC0402FR-071KL: RES 1.00K OHM 1/16W 1% 0402 SMD; Manufacturer: Yageo; Power (Watts): 0.063W, 1/16W; .Checked PCB: used; Temperature Coefficient: ±100ppm/°C; Category: Resistors; Supplier Part Number: 311-1.00KLRCT-ND; Manufacturer Part Number: RC0402FR-071KL; Package / Case: 0402 (1005 Metric); Price 1k [$]: 0.01421; Resistance (Ohms): 1K; Tolerance: ±1%; Value: 1k; .Checked SCH: used; Supplier: Digikey; Supplier 1: Digi-Key; Supplier Part Number 1: 311-1.00KLRCT-ND; RoHS: RoHS Compliant; Stock 1: 1753477; Pricing 1: 10=0.014, 50=0.0104, 100=0.0079, 250=0.00584, 500=0.00432, 1000=0.00288 (USD); Composition: Thick Film; Features: -; Size / Dimension: 0.039" L x 0.020" W (1.00mm x 0.50mm); Height: 0.016" (0.40mm); Number of Terminations: 2; Packaging: Cut Tape (CT); ComponentLink1URL: http://www.yageo.com/documents/recent/PYu-RC0402_51_RoHS_L_6.pdf; ComponentLink1Description: http://www.yageo.com/documents/recent/PYu-RC0402_51_RoHS_L_6.pdf
R131-R137 = RC0402FR-0710KL: RES 10.0K OHM 1/16W 1% 0402 SMD; Manufacturer: Yageo; Power (Watts): 0.063W, 1/16W; .Checked PCB: used; Temperature Coefficient: ±100ppm/°C; Category: Resistors; Supplier Part Number: 311-10.0KLRCT-ND; Manufacturer Part Number: RC0402FR-0710KL; Package / Case: 0402 (1005 Metric); Price 1k [$]: 0.01421; Resistance (Ohms): 10K; Tolerance: ±1%; Value: 10k; .Checked SCH: used; Supplier: Digikey; Supplier 1: Digi-Key; Supplier Part Number 1: 311-10.0KLRCT-ND; RoHS: RoHS Compliant; Stock 1: 2916495; Pricing 1: 10=0.014, 50=0.0104, 100=0.0079, 250=0.00584, 500=0.00432, 1000=0.00288 (USD); Composition: Thick Film; Features: -; Size / Dimension: 0.039" L x 0.020" W (1.00mm x 0.50mm); Height: 0.016" (0.40mm); Number of Terminations: 2; Packaging: Cut Tape (CT); ComponentLink1URL: http://www.yageo.com/documents/recent/PYu-RC0402_51_RoHS_L_6.pdf; ComponentLink1Description: http://www.yageo.com/documents/recent/PYu-RC0402_51_RoHS_L_6.pdf
TP9 TP10 = TP_25MILC: Test Point 25mil; .Checked PCB: used
U14 = KSZ9031RNXIA: IC TXRX ETHERNET 48-QFN; Manufacturer: Micrel Inc; Number of Drivers/Receivers: 4/4; Duplex: Full; Voltage - Supply: 1.8V, 2.5V, 3.3V; .Creator: MM; .Checked PCB: used; Supplier 1: Digi-Key; Manufacturer Part Number: KSZ9031RNXIA; RoHS: RoHS Compliant; Category: Integrated Circuits (ICs); Stock 1: 1755; Pricing 1: 1=6.69, 10=5.975, 50=5.3776, 100=4.8995, 250=4.42152, 500=3.9674, 1000=3.346, 2500=3.1787, 5000=3.04725 (USD); Packaging: Tray; Type: Transceiver; Protocol: Ethernet; Receiver Hysteresis: -; Data Rate: -; Operating Temperature: -40°C ~ 85°C; Mounting Type: Surface Mount; Package / Case: 48-VFQFN Exposed Pad; Supplier Device Package: 48-QFN (7x7); ComponentLink1URL: http://www.micrel.com/_PDF/Ethernet/datasheets/KSZ9031RNX.pdf; ComponentLink1Description: http://www.micrel.com/_PDF/Ethernet/datasheets/KSZ9031RNX.pdf; Supplier Part Number 1: 576-4346-ND; .Checked SCH: used
U15 = MIC33050-4YHL TR: IC PWM REG 600mA 1.2V 12-MLF; Manufacturer: Micrel Inc; .Checked PCB: used; Voltage - Input: 2.7 V ~ 5.5 V; Output Type: Fixed; Number of Outputs: 1; PWM Type: Current Mode; Frequency - Switching: 4MHz; Synchronous Rectifier: Yes; .Checked SCH: used; Category: Integrated Circuits (ICs); Supplier Part Number: 576-3044-1-ND; Family: PMIC - Voltage Regulators - Switching DC DC Converters & Controllers; Manufacturer Part Number: MIC33050-4YHL TR; Operating Temperature: -40°C ~ 125°C; Package / Case: 12-MLF®, QFN; Price 1k [$]: 1.62500; Value: MIC33050-4YHL TR; Voltage - Output: 1.2V; Current - Output: 600mA; Supplier: Digikey; Supplier 1: Digi-Key; Supplier Part Number 1: 576-3044-1-ND; RoHS: RoHS Compliant; Stock 1: 1750; Pricing 1: 1=2.34, 25=1.872, 100=1.456, 250=1.3832, 500=1.352 (USD); Type: Step-Down (Buck); Mounting Type: Surface Mount; Packaging: Cut Tape (CT); Supplier Device Package: 12-MLF™ (3x3); ComponentLink1URL: http://www.micrel.com/_PDF/mic33050.pdf; ComponentLink1Description: http://www.micrel.com/_PDF/mic33050.pdf
Y3 = ABM8G-25.000MHZ-18-D2Y-T: CRYSTAL 25MHZ 18PF SMD; Manufacturer: Abracon Corporation; Frequency Stability: ±30ppm; Frequency Tolerance: ±20ppm; ESR (Equivalent Series Resistance): 60 Ohm; Operating Mode: Fundamental; .Checked PCB: used; .Creator: MM; Supplier 1: Digi-Key; Manufacturer Part Number: ABM8G-25.000MHZ-18-D2Y-T; RoHS: RoHS Compliant; Category: Crystals and Oscillators; Stock 1: 25549; Pricing 1: 1=1.06, 10=0.944, 50=0.8814, 100=0.78, 500=0.7371 (USD); Packaging: Cut Tape (CT); Type: MHz Crystal; Frequency: 25MHz; Load Capacitance: 18pF; Operating Temperature: -40°C ~ 85°C; Ratings: -; Mounting Type: Surface Mount; Package / Case: 4-SMD, No Lead (DFN, LCC); Size / Dimension: 0.126" L x 0.098" W (3.20mm x 2.50mm); Height: 0.039" (1.00mm); ComponentLink1URL: http://www.abracon.com/Resonators/ABM8G.pdf; ComponentLink1Description: http://www.abracon.com/Resonators/ABM8G.pdf; Supplier Part Number 1: 535-10275-1-ND; .Checked SCH: used